# EAGLE schematic Battery Control (EAGLE 9.0.0)
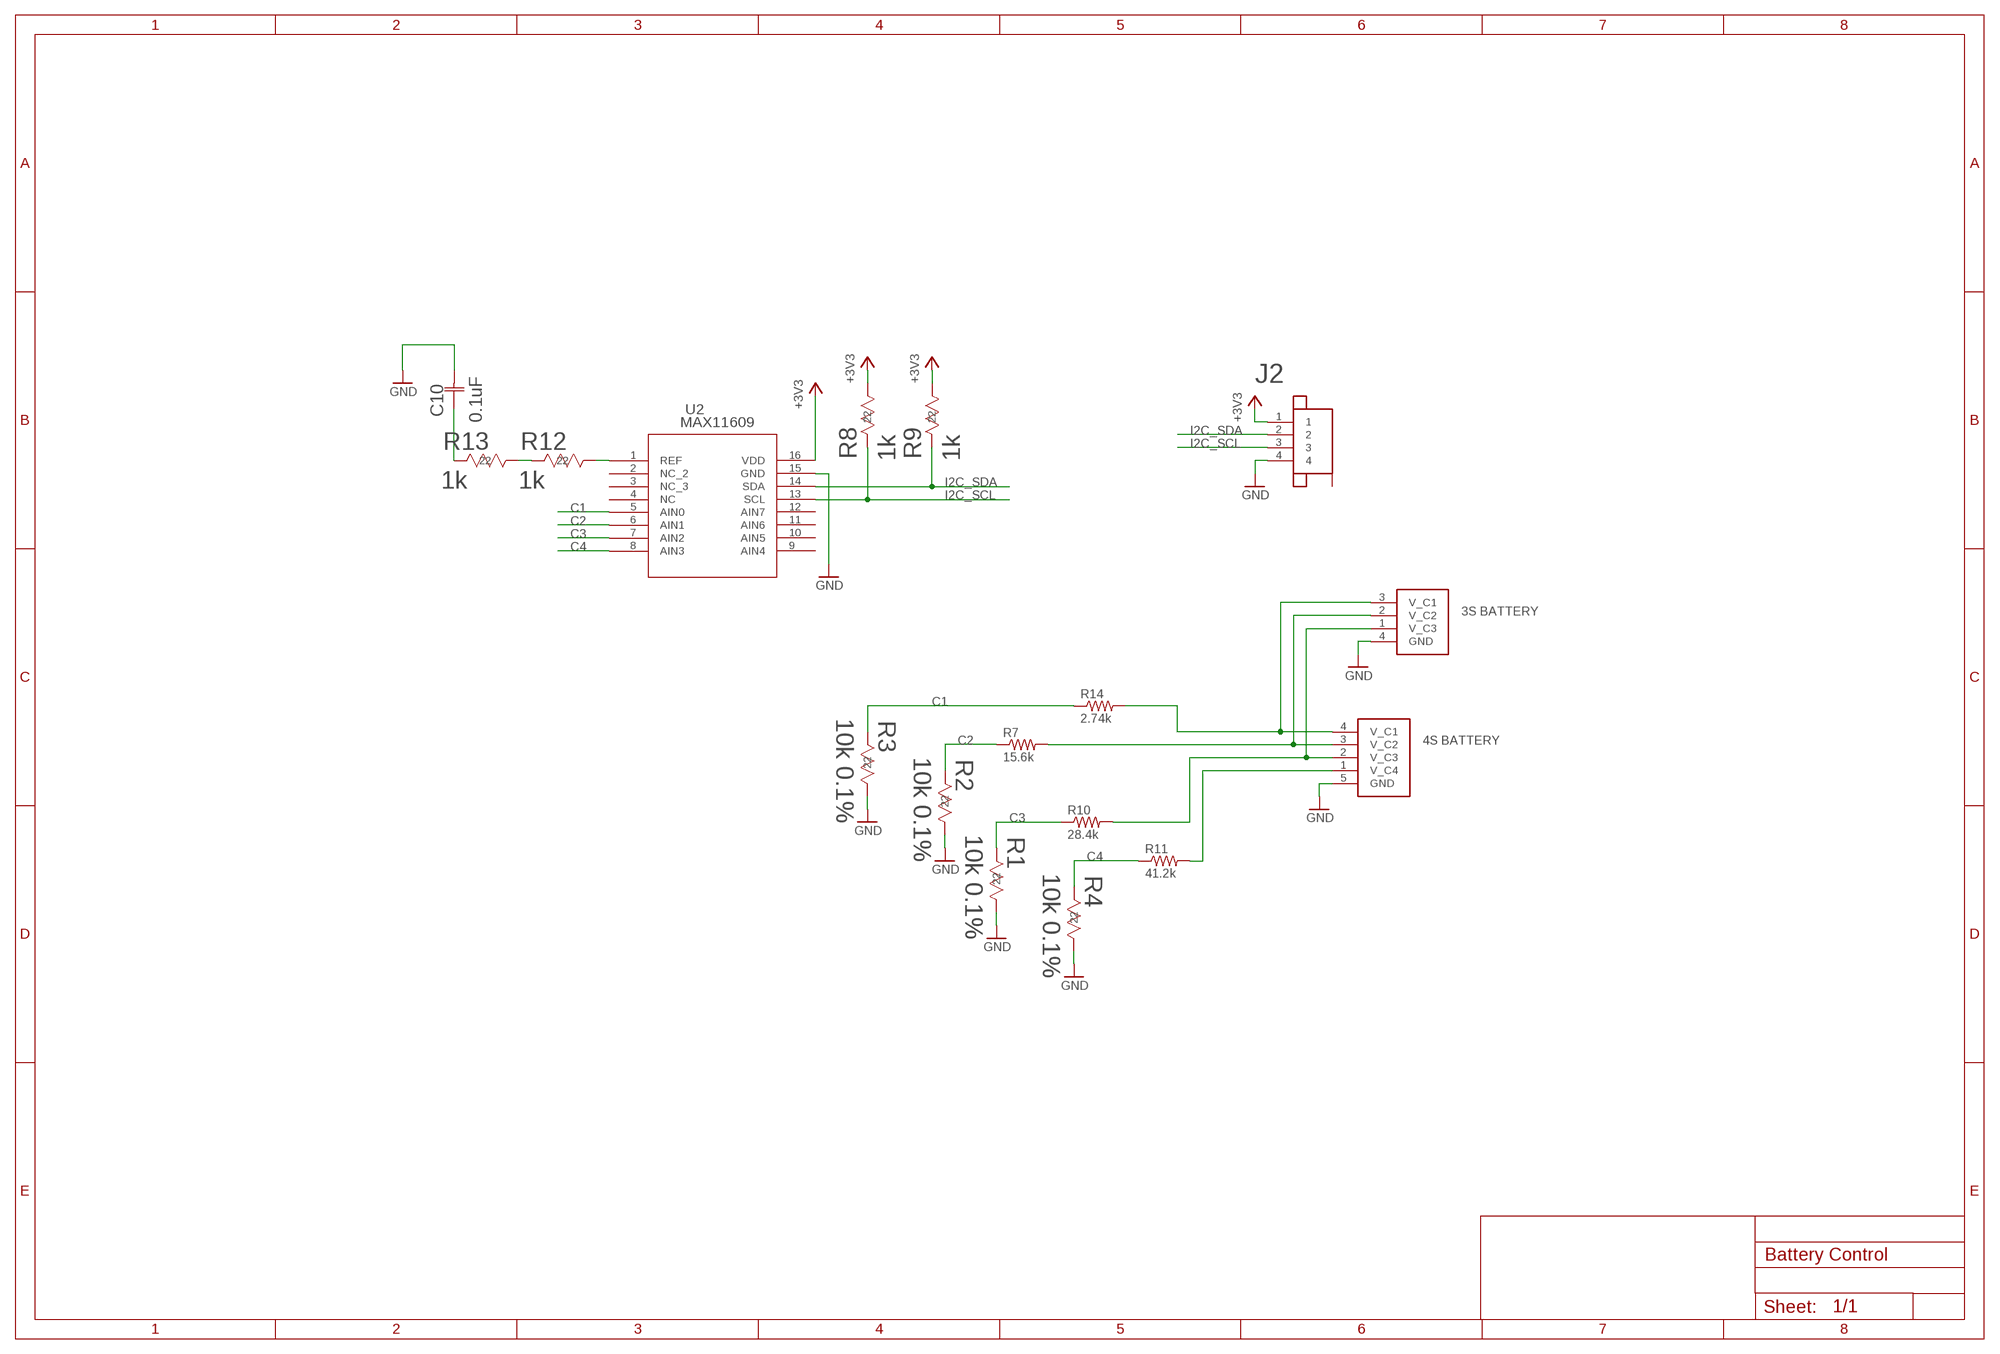
[diagram p0: schematic, sheet 1]

## Parts
C10  0.1uF  08055C104KAT2A  [0805]
J1  JST-XH_4POS  [JST-XH_4POS]
J2  JST_SH_4POS  [JST_SH_4POS]
J3  JST-XH_5POS  [JST-XH_5POS]
R1  10k 0.1%  ERA-6AEB103V  [RC0805N]
R2  10k 0.1%  ERA-6AEB103V  [RC0805N]
R3  10k 0.1%  ERA-6AEB103V  [RC0805N]
R4  10k 0.1%  ERA-6AEB103V  [RC0805N]
R7  15.6k  TNPW040215K6BEED  [R0402]
R8  1k  RC0603JR-071KLRC0603N-M  [RC0603N-M]
R9  1k  RC0603JR-071KLRC0603N-M  [RC0603N-M]
R10  28.4k  RT0603BRD0728K4L  [R0603]
R11  41.2k  ERA-3AEB4122V  [R0603]
R12  1k  RC0603JR-071KLRC0603N-M  [RC0603N-M]
R13  1k  RC0603JR-071KLRC0603N-M  [RC0603N-M]
R14  2.74k  ERA-3AEB2741V  [R0603]
U2  MAX11608EEE+21-0055H_16-M  [21-0055H_16-M]

## Nets
+3V3: J2.1 R8.1 R9.1 U2.16(VDD)
C1: R3.2 R14.1 U2.5(AIN0)
C2: R2.2 R7.1 U2.6(AIN1)
C3: R1.2 R10.1 U2.7(AIN2)
C4: R4.2 R11.1 U2.8(AIN3)
GND: C10.2 J1.4(GND) J2.4 J3.5(GND) R1.1 R2.1 R3.1 R4.1 U2.15(GND)
I2C_SCL: J2.3 R8.2 U2.13(SCL)
I2C_SDA: J2.2 R9.2 U2.14(SDA)
N$1: R12.1 U2.1(REF)
N$8: J1.3(V_C1) J3.4(V_C1) R14.2
N$10: J1.2(V_C2) J3.3(V_C2) R7.2
N$13: J1.1(V_C3) J3.2(V_C3) R10.2
N$16: J3.1(V_C4) R11.2
N$24: R12.2 R13.1
N$28: C10.1 R13.2
Unconnected: J2.P$5 J2.P$6 U2.2(NC_2) U2.3(NC_3) U2.4(NC) U2.9(AIN4) U2.10(AIN5) U2.11(AIN6) U2.12(AIN7)

## Library data of the parts
C10 = Controller Board:08055C104KAT2A; COPYRIGHT: Copyright C 2015 Accelerated Designs. All rights reserved; MANUFACTURER_PART_NUMBER: 08055C104KAT2A; VENDOR: Vendor
J1 = thanics-connector:JST-XH_4POS
J2 = thanics_robotics:JST_SH_4POS
J3 = thanics-connector:JST-XH_5POS
R1-R4 = 10k-resistor:ERA-6AEB103V; CASE: 0805 2012 metric; COMPOSITION: Thin Film; COPYRIGHT: Copyright C 2015 Accelerated Designs. All rights reserved; DATASHEET: httpindustrial.panasonic.comwwwcgijvcr13pz.cgi?E+PZ+3+AOA0026+ERA6AEB103V+7+WW; DIGIKEYPARTNUMBER: P10KDATRND; HEIGHT: 0.024" 0.60mm; LEADSTYLE: Surface Mount SMD SMT; MANUFACTURER_PART_NUMBER: ERA6AEB103V; NUMBEROFTERMINATIONS: 2; PACKAGECASE: 0805 2012 Metric; PACKAGING: Tape &amp Reel TR; POWERWATTS: 0.125W 18W; QUANTITY_AVAILABLE: 225000; RESISTANCEINOHMS: 10.0K; RESISTANCEOHMS: 10K; SIZEDIMENSION: 0.079" L x 0.049" W 2.00mm x 1.25mm; TEMPERATURECOEFFICIENT: 25ppm°C; TOLERANCE: 0.1%; VENDOR: Panasonic; VOLTAGEWORKING: 100V
R7 = thanics-resistor:TNPW040215K6BEED; TOLERANCE: 0.1%
R8 R9 R12 R13 = Controller Board:RC0603JR-071KL; CASE: 0603 1608 metric; COMPOSITION: Thick Film; COPYRIGHT: Copyright C 2015 Accelerated Designs. All rights reserved; DATASHEET: httpwww.yageo.comdocumentsrecentPYuRC0603_51_RoHS_L_4.pdf; DESCRIPTION: RES 1.0K OHM 110W 5% 0603 SMD; DIGIKEYPARTNUMBER: 3111.0KGRTRND; HEIGHT: 0.022" 0.55mm; LEADSTYLE: Surface Mount SMD SMT; MANUFACTURER_PART_NUMBER: RC0603JR071KL; NEWARKPARTNUMBER: 14M7231; NUMBEROFTERMINATIONS: 2; PACKAGECASE: 0603 1608 Metric; PACKAGING: Tape &amp Reel TR; POWERWATTS: 0.1W 110W; QUANTITY_AVAILABLE: 0; RESISTANCEINOHMS: 1.00K; RESISTANCEOHMS: 1K; SIZEDIMENSION: 0.063" L x 0.031" W 1.60mm x 0.80mm; TEMPERATURECOEFFICIENT: 100ppm°C; TOLERANCE: 5%; VENDOR: Yageo; VOLTAGEWORKING: 50V
R10 = thanics-resistor:RT0603BRD0728K4L; TOLERANCE: 0.1%
R11 = thanics-resistor:ERA-3AEB4122V; TOLERANCE: 0.1%
R14 = thanics-resistor:ERA-3AEB2741V; TOLERANCE: 0.1%
U2 = 8ch ADC:MAX11608EEE+; COPYRIGHT: Copyright C 2015 Accelerated Designs. All rights reserved; DATAINTERFACE: I²C Serial; DATASHEET: httpdatasheets.maximic.comendsMAX11606MAX11611.pdf; DESCRIPTION: IC ADC SERIAL 10BIT 8CH 16QSOP; DIGIKEYPARTNUMBER: MAX11608EEE+ND; MANUFACTURER_PART_NUMBER: MAX11608EEE+; MOUNTINGTYPE: Surface Mount; NUMBEROFBITS: 10; NUMBEROFCONVERTERS: 1; NUMBEROFINPUTSANDTYPE: 8 SingleEnded Unipolar 8 SingleEnded Bipolar 4 Differential Unipolar 4 Differential Bipolar; OPERATINGTEMPERATURE: 40°C ~ 85°C; PACKAGECASE: 16SSOP 0.154" 3.90mm Width; PACKAGING: Tube; POWERDISSIPATIONMAX: 666.7mW; QUANTITY_AVAILABLE: 814; SAMPLINGRATEPERSECOND: 94.4k; SUPPLIERDEVICEPACKAGE: 16QSOP; VENDOR: Maxim Integrated Products; VOLTAGESUPPLYSOURCE: Single Supply